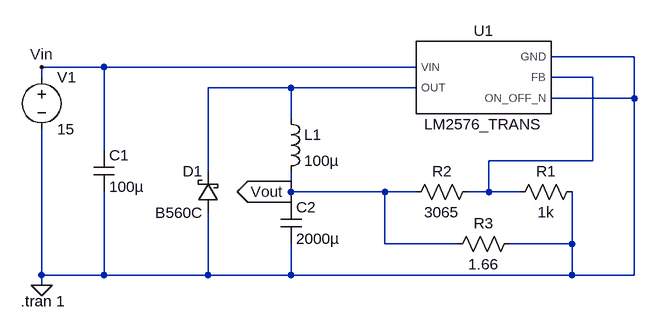
[diagram p0: schematic regulator_cct.asc]
regulator_cct.asc, the LTspice schematic file:
Version 4
SHEET 1 2052 680
WIRE 848 96 720 96
WIRE 32 112 -64 112
WIRE 512 112 32 112
WIRE -64 128 -64 112
WIRE 784 128 720 128
WIRE 320 144 192 144
WIRE 512 144 320 144
WIRE 848 160 848 96
WIRE 848 160 720 160
WIRE 320 192 320 144
WIRE 32 240 32 112
WIRE 784 256 784 128
WIRE 784 256 624 256
WIRE 192 272 192 144
WIRE 320 304 320 272
WIRE 464 304 320 304
WIRE 512 304 464 304
WIRE 624 304 624 256
WIRE 624 304 592 304
WIRE 672 304 624 304
WIRE 320 320 320 304
WIRE 464 384 464 304
WIRE 576 384 464 384
WIRE 752 384 752 304
WIRE 752 384 656 384
WIRE -64 432 -64 208
WIRE 32 432 32 304
WIRE 32 432 -64 432
WIRE 192 432 192 336
WIRE 192 432 32 432
WIRE 320 432 320 384
WIRE 320 432 192 432
WIRE 752 432 752 384
WIRE 752 432 320 432
WIRE 848 432 848 160
WIRE 848 432 752 432
WIRE -64 448 -64 432
FLAG -64 448 0
FLAG -64 112 Vin
FLAG 320 304 Vout
IOPIN 320 304 Out
SYMBOL LM2576_TRANS 608 128 R0
SYMATTR InstName U1
SYMBOL voltage -64 112 R0
SYMATTR InstName V1
SYMATTR Value 15
SYMBOL cap 16 240 R0
SYMATTR InstName C1
SYMATTR Value 100µ
SYMBOL cap 304 320 R0
SYMATTR InstName C2
SYMATTR Value 2000µ
SYMBOL schottky 208 336 R180
WINDOW 0 24 64 Left 2
WINDOW 3 24 0 Left 2
SYMATTR InstName D1
SYMATTR Value B560C
SYMATTR Description Diode
SYMATTR Type diode
SYMBOL ind 304 176 R0
SYMATTR InstName L1
SYMATTR Value 100µ
SYMBOL res 608 288 R90
WINDOW 0 0 56 VBottom 2
WINDOW 3 32 56 VTop 2
SYMATTR InstName R2
SYMATTR Value 3065
SYMBOL res 768 288 R90
WINDOW 0 0 56 VBottom 2
WINDOW 3 32 56 VTop 2
SYMATTR InstName R1
SYMATTR Value 1k
SYMBOL res 672 368 R90
WINDOW 0 0 56 VBottom 2
WINDOW 3 32 56 VTop 2
SYMATTR InstName R3
SYMATTR Value 1.66
TEXT -96 472 Left 2 !.tran 1

The netlist it stands for:
* regulator_cct.asc
XU1 Vin N002 0 N001 0 LM2576_TRANS  ; pins VIN OUT GND FB ON_OFF_N
V1 Vin 0 15
C1 Vin 0 100µ
C2 Vout 0 2000µ
D1 0 N002 B560C
L1 N002 Vout 100µ
R2 N001 Vout 3065
R1 0 N001 1k
R3 0 Vout 1.66
.model D D
.lib standard.dio
.tran 1
.lib D:\Documents\EE Cloud\ELE\Graduation Project\Simulation Files\models\snvmb27\LM2576_TRANS.LIB
.backanno
.end